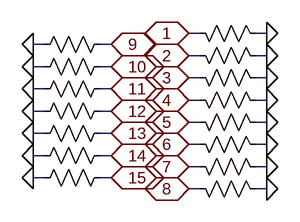
[diagram p0: schematic DB15.asc]
DB15.asc, the LTspice schematic file:
Version 4
SHEET 1 880 680
WIRE 336 112 320 112
WIRE 432 112 416 112
WIRE 112 128 96 128
WIRE 208 128 192 128
WIRE 336 144 320 144
WIRE 432 144 416 144
WIRE 112 160 96 160
WIRE 208 160 192 160
WIRE 336 176 320 176
WIRE 432 176 416 176
WIRE 112 192 96 192
WIRE 208 192 192 192
WIRE 336 208 320 208
WIRE 432 208 416 208
WIRE 112 224 96 224
WIRE 208 224 192 224
WIRE 336 240 320 240
WIRE 432 240 416 240
WIRE 112 256 96 256
WIRE 208 256 192 256
WIRE 336 272 320 272
WIRE 432 272 416 272
WIRE 112 288 96 288
WIRE 208 288 192 288
WIRE 336 304 320 304
WIRE 432 304 416 304
WIRE 112 320 96 320
WIRE 208 320 192 320
WIRE 336 336 320 336
WIRE 432 336 416 336
FLAG 320 112 1
IOPIN 320 112 BiDir
FLAG 320 144 2
IOPIN 320 144 BiDir
FLAG 320 176 3
IOPIN 320 176 BiDir
FLAG 320 208 4
IOPIN 320 208 BiDir
FLAG 320 240 5
IOPIN 320 240 BiDir
FLAG 320 272 6
IOPIN 320 272 BiDir
FLAG 320 304 7
IOPIN 320 304 BiDir
FLAG 320 336 8
IOPIN 320 336 BiDir
FLAG 208 128 9
IOPIN 208 128 BiDir
FLAG 208 160 10
IOPIN 208 160 BiDir
FLAG 208 192 11
IOPIN 208 192 BiDir
FLAG 208 224 12
IOPIN 208 224 BiDir
FLAG 208 256 13
IOPIN 208 256 BiDir
FLAG 208 288 14
IOPIN 208 288 BiDir
FLAG 208 320 15
IOPIN 208 320 BiDir
FLAG 432 112 0
FLAG 432 144 0
FLAG 432 176 0
FLAG 432 208 0
FLAG 432 240 0
FLAG 432 272 0
FLAG 432 304 0
FLAG 432 336 0
FLAG 96 128 0
FLAG 96 160 0
FLAG 96 192 0
FLAG 96 224 0
FLAG 96 256 0
FLAG 96 288 0
FLAG 96 320 0
SYMBOL res 320 96 M90
WINDOW 0 0 56 Invisible 2
WINDOW 3 32 56 Invisible 2
SYMATTR InstName R1
SYMATTR Value 1G
SYMBOL res 320 128 M90
WINDOW 0 0 56 Invisible 2
WINDOW 3 32 56 Invisible 2
SYMATTR InstName R2
SYMATTR Value 1G
SYMBOL res 320 160 M90
WINDOW 0 0 56 Invisible 2
WINDOW 3 32 56 Invisible 2
SYMATTR InstName R3
SYMATTR Value 1G
SYMBOL res 320 192 M90
WINDOW 0 0 56 Invisible 2
WINDOW 3 32 56 Invisible 2
SYMATTR InstName R4
SYMATTR Value 1G
SYMBOL res 320 224 M90
WINDOW 0 0 56 Invisible 2
WINDOW 3 32 56 Invisible 2
SYMATTR InstName R5
SYMATTR Value 1G
SYMBOL res 320 256 M90
WINDOW 0 0 56 Invisible 2
WINDOW 3 32 56 Invisible 2
SYMATTR InstName R6
SYMATTR Value 1G
SYMBOL res 320 288 M90
WINDOW 0 0 56 Invisible 2
WINDOW 3 32 56 Invisible 2
SYMATTR InstName R7
SYMATTR Value 1G
SYMBOL res 320 320 M90
WINDOW 0 0 56 Invisible 2
WINDOW 3 32 56 Invisible 2
SYMATTR InstName R8
SYMATTR Value 1G
SYMBOL res 208 112 R90
WINDOW 0 0 56 Invisible 2
WINDOW 3 32 56 Invisible 2
SYMATTR InstName R9
SYMATTR Value 1G
SYMBOL res 208 144 R90
WINDOW 0 0 56 Invisible 2
WINDOW 3 32 56 Invisible 2
SYMATTR InstName R10
SYMATTR Value 1G
SYMBOL res 208 176 R90
WINDOW 0 0 56 Invisible 2
WINDOW 3 32 56 Invisible 2
SYMATTR InstName R11
SYMATTR Value 1G
SYMBOL res 208 208 R90
WINDOW 0 0 56 Invisible 2
WINDOW 3 32 56 Invisible 2
SYMATTR InstName R12
SYMATTR Value 1G
SYMBOL res 208 240 R90
WINDOW 0 0 56 Invisible 2
WINDOW 3 32 56 Invisible 2
SYMATTR InstName R13
SYMATTR Value 1G
SYMBOL res 208 272 R90
WINDOW 0 0 56 Invisible 2
WINDOW 3 32 56 Invisible 2
SYMATTR InstName R14
SYMATTR Value 1G
SYMBOL res 208 304 R90
WINDOW 0 0 56 Invisible 2
WINDOW 3 32 56 Invisible 2
SYMATTR InstName R15
SYMATTR Value 1G

The netlist it stands for:
* DB15.asc
R1 1 0 1G
R2 2 0 1G
R3 3 0 1G
R4 4 0 1G
R5 5 0 1G
R6 6 0 1G
R7 7 0 1G
R8 8 0 1G
R9 9 0 1G
R10 10 0 1G
R11 11 0 1G
R12 12 0 1G
R13 13 0 1G
R14 14 0 1G
R15 15 0 1G
.backanno
.end